# Altium schematic sheet CPU.SchDoc
size A3; SheetNumber: 1; SheetTotal: 1
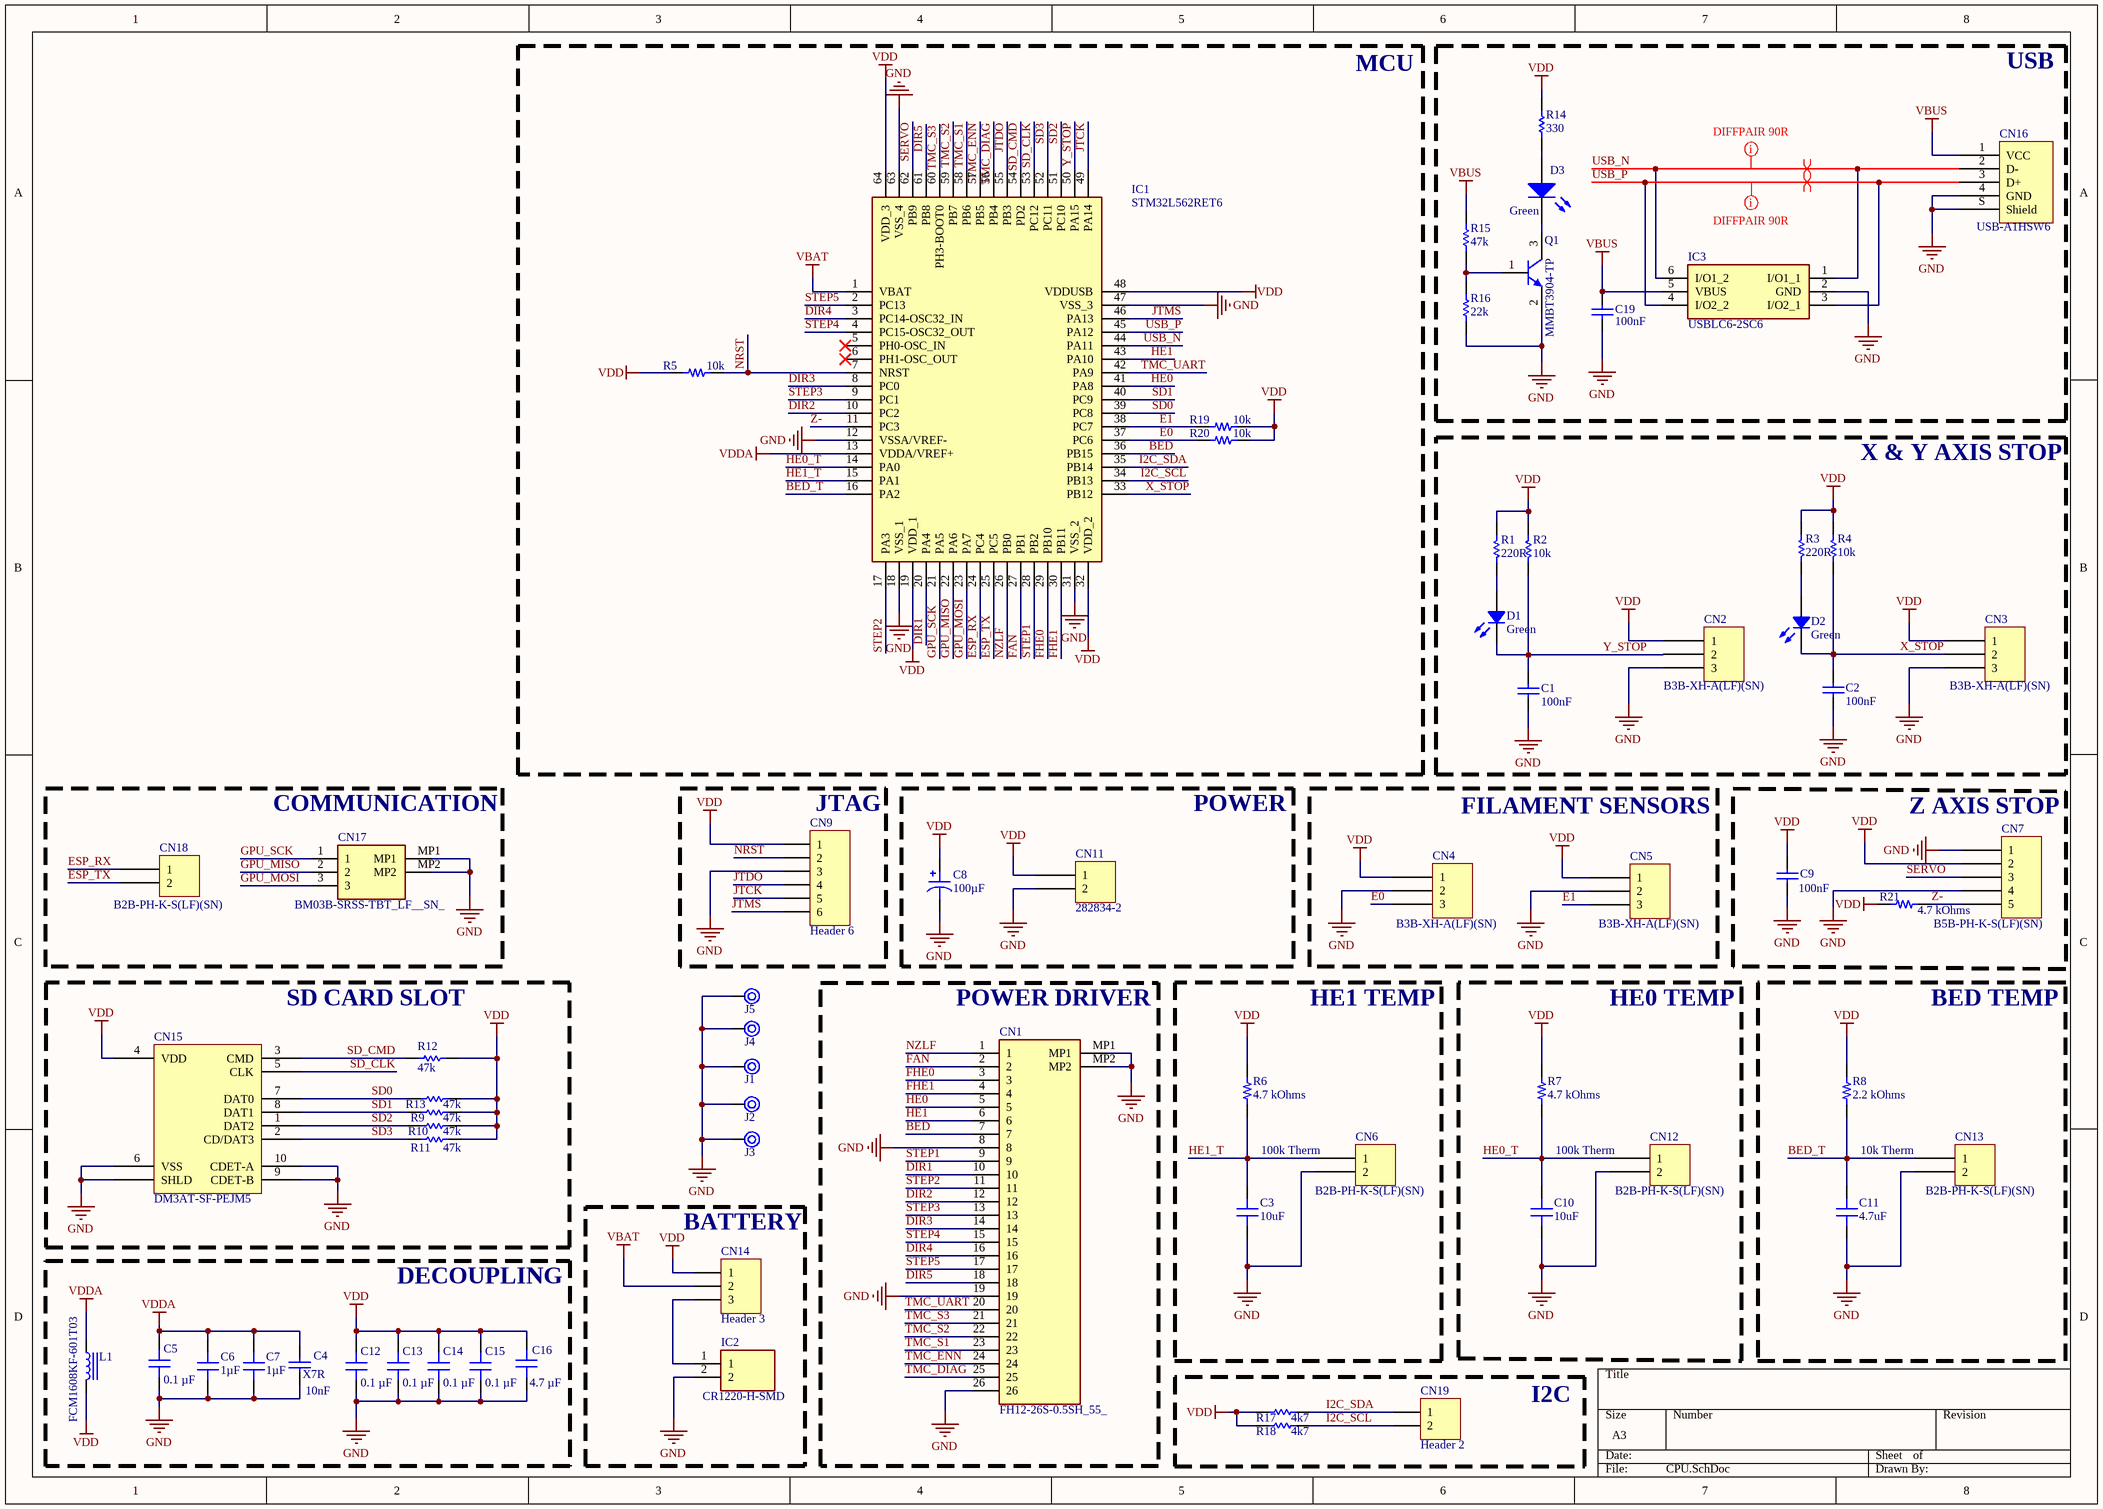
[diagram p0: CPU.SchDoc]

## Parts
C1  value 100nF  [1608[0603]]  (hidden comment: X5R)
C2  value 100nF  [1608[0603]]  (hidden comment: X5R)
C3  10uF  [CAP 0603_1608]
C4  X7R  value 10nF  [1608[0603]]
C5  0.1 µF  [CAP 0603_1608]
C6  1µF  [CAP 0603_1608]
C7  1µF  [CAP 0603_1608]
C8  100µF  [CAP ALSMD POLY 5.3MM H6.0MM]
C9  value 100nF  [1608[0603]]  (hidden comment: X5R)
C10  10uF  [CAP 0603_1608]
C11  4.7uF  [CAP 0603_1608]
C12  0.1 µF  [CAP 0603_1608]
C13  0.1 µF  [CAP 0603_1608]
C14  0.1 µF  [CAP 0603_1608]
C15  0.1 µF  [CAP 0603_1608]
C16  4.7 µF  [CAP 0603_1608]
C19  value 100nF  [1608[0603]]  (hidden comment: Cap)
CN1  FH12-26S-0.5SH_55_  [FH1226S05SH55]
CN2  B3B-XH-A(LF)(SN)  [JST XH B3B-XH-A]
CN3  B3B-XH-A(LF)(SN)  [JST XH B3B-XH-A]
CN4  B3B-XH-A(LF)(SN)  [JST XH B3B-XH-A]
CN5  B3B-XH-A(LF)(SN)  [JST XH B3B-XH-A]
CN6  B2B-PH-K-S(LF)(SN)  [JST B2B-PH-K]
CN7  B5B-PH-K-S(LF)(SN)  [JST B5B-PH-K]
CN9  Header 6  [HDR1X6]
CN11  282834-2  [TE 282834-2]
CN12  B2B-PH-K-S(LF)(SN)  [JST B2B-PH-K]
CN13  B2B-PH-K-S(LF)(SN)  [JST B2B-PH-K]
CN14  Header 3  [HDR1X3]
CN15  DM3AT-SF-PEJM5  [HIROSE DM3AT-SF-PEJM5]
CN16  USB-A1HSW6  [ON SHORE TECHNOLOGY USB-A1HSW6]
CN17  BM03B-SRSS-TBT_LF__SN_  [BM03BSRSSTBTLFSN]
CN18  B2B-PH-K-S(LF)(SN)  [JST B2B-PH-K]
CN19  Header 2  [HDR1X2]
D1  Green  [LED 0805_2012 GREEN]
D2  Green  [LED 0805_2012 GREEN]
D3  Green  [1608[0603]]
IC1  STM32L562RET6  [QFP50P1200X1200X160-64N]
IC2  CR1220-H-SMD  [CR1220HSMD]
IC3  USBLC6-2SC6  [SOT95P280X145-6N]
J1  PTH 3.2mm  [PTH 3.2mm]  (value not drawn)
J2  PTH 3.2mm  [PTH 3.2mm]  (value not drawn)
J3  PTH 3.2mm  [PTH 3.2mm]  (value not drawn)
J4  PTH 3.2mm  [PTH 3.2mm]  (value not drawn)
J5  PTH 3.2mm  [PTH 3.2mm]  (value not drawn)
L1  FCM1608KF-601T03  [IND 0603_1608 RF WW]
Q1  MMBT3904-TP  [MCCSEMI SOT-23-3]
R1  value 220R  [1608[0603]]  (hidden comment: Res1)
R2  value 10k  [1608[0603]]  (hidden comment: Res1)
R3  value 220R  [1608[0603]]  (hidden comment: Res1)
R4  value 10k  [1608[0603]]  (hidden comment: Res1)
R5  10k  [RES 0603_1608]
R6  4.7 kOhms  [RES 0603_1608]
R7  4.7 kOhms  [RES 0603_1608]
R8  2.2 kOhms  [RES 0603_1608]
R9  value 47k  [1608[0603]]  (hidden comment: Res1)
R10  value 47k  [1608[0603]]  (hidden comment: Res1)
R11  value 47k  [1608[0603]]  (hidden comment: Res1)
R12  value 47k  [1608[0603]]  (hidden comment: Res1)
R13  value 47k  [1608[0603]]  (hidden comment: Res1)
R14  value 330  [1608[0603]]  (hidden comment: Res1)
R15  value 47k  [1608[0603]]  (hidden comment: Res1)
R16  value 22k  [1608[0603]]  (hidden comment: Res1)
R17  value 4k7  [1608[0603]]  (hidden comment: Res1)
R18  value 4k7  [1608[0603]]  (hidden comment: Res1)
R19  10k  [RES 0603_1608]
R20  10k  [RES 0603_1608]
R21  4.7 kOhms  [RES 0603_1608]

## Blocks framed on the sheet
MCU: IC1 R5 R19 R20
USB: C19 CN16 D3 IC3 Q1 R14-R16
X & Y AXIS STOP: C1 C2 CN2 CN3 D1 D2 R1-R4
COMMUNICATION: CN17 CN18
JTAG: CN9
POWER: C8 CN11
FILAMENT SENSORS: CN4 CN5
Z AXIS STOP: C9 CN7 R21
SD CARD SLOT: CN15 R9-R13
POWER DRIVER: CN1
HE1 TEMP: C3 CN6 R6
HE0 TEMP: C10 CN12 R7
BED TEMP: C11 CN13 R8
BATTERY: CN14 IC2
DECOUPLING: C4-C7 C12-C16 L1
I2C: CN19 R17 R18

## Nets
GND: C1.2 C2.2 C3.1 C4.1 C5.1 C6.1 C7.1 C8.2 C9.2 C10.1 C11.1 C12.1 C13.1 C14.1 C15.1 C16.1 C19.1 CN1.8 CN1.19 CN1.26 CN1.MP1 CN1.MP2 CN2.3 CN3.3 CN4.2 CN5.2 CN6.2 CN7.1 CN7.4 CN9.3 CN11.2 CN12.2 CN13.2 CN15.6(VSS) CN15.9(CDET-B) CN15.10(CDET-A) CN15.S(SHLD) CN16.4(GND) CN16.S(Shield) CN17.MP1 CN17.MP2 IC1.12(VSSA/VREF-) IC1.18(VSS_1) IC1.31(VSS_2) IC1.47(VSS_3) IC1.63(VSS_4) IC2.2 IC3.2(GND) J1.0 J2.0 J3.0 J4.0 J5.0 Q1.2(E) R16.1
VBAT: CN14.2 IC1.1(VBAT)
VBUS: C19.2 CN16.1(VCC) IC3.5(VBUS) R15.2
VDD: C8.1 C9.1 C12.2 C13.2 C14.2 C15.2 C16.2 CN2.1 CN3.1 CN4.1 CN5.1 CN7.2 CN9.1 CN11.1 CN14.1 CN15.4(VDD) IC1.19(VDD_1) IC1.32(VDD_2) IC1.48(VDDUSB) IC1.64(VDD_3) L1.2 R1.1 R2.1 R3.1 R4.1 R5.1 R6.2 R7.2 R8.2 R9.1 R10.2 R11.2 R12.1 R13.2 R14.2 R17.1 R18.1 R19.2 R20.2 R21.2
VDDA: C4.2 C5.2 C6.2 C7.2 IC1.13(VDDA/VREF+) L1.1
BED: CN1.7 IC1.36(PB15)
BED_T: C11.2 CN13.1 IC1.16(PA2) R8.1
DIR1: CN1.10 IC1.20(PA4)
DIR2: CN1.12 IC1.10(PC2)
DIR3: CN1.14 IC1.8(PC0)
DIR4: CN1.16 IC1.3(PC14-OSC32_IN)
DIR5: CN1.18 IC1.61(PB8)
E0: CN4.3 IC1.37(PC6) R20.1
E1: CN5.3 IC1.38(PC7) R19.1
ESP_RX: CN18.1 IC1.24(PC4)
ESP_TX: CN18.2 IC1.25(PC5)
FAN: CN1.2 IC1.27(PB1)
FHE0: CN1.3 IC1.29(PB10)
FHE1: CN1.4 IC1.30(PB11)
GPU_MISO: CN17.2 IC1.22(PA6)
GPU_MOSI: CN17.3 IC1.23(PA7)
GPU_SCK: CN17.1 IC1.21(PA5)
HE0: CN1.5 IC1.41(PA8)
HE0_T: C10.2 CN12.1 IC1.14(PA0) R7.1
HE1: CN1.6 IC1.43(PA10)
HE1_T: C3.2 CN6.1 IC1.15(PA1) R6.1
I2C_SCL: CN19.2 IC1.34(PB13) R18.2
I2C_SDA: CN19.1 IC1.35(PB14) R17.2
JTCK: CN9.5 IC1.49(PA14)
JTDO: CN9.4 IC1.55(PB3)
JTMS: CN9.6 IC1.46(PA13)
NRST: CN9.2 IC1.7(NRST) R5.2
NZLF: CN1.1 IC1.26(PB0)
SD0: CN15.7(DAT0) IC1.39(PC8) R13.1
SD1: CN15.8(DAT1) IC1.40(PC9) R9.2
SD2: CN15.1(DAT2) IC1.51(PC10) R10.1
SD3: CN15.2(CD/DAT3) IC1.52(PC11) R11.1
SD_CLK: CN15.5(CLK) IC1.53(PC12)
SD_CMD: CN15.3(CMD) IC1.54(PD2) R12.2
SERVO: CN7.3 IC1.62(PB9)
STEP1: CN1.9 IC1.28(PB2)
STEP2: CN1.11 IC1.17(PA3)
STEP3: CN1.13 IC1.9(PC1)
STEP4: CN1.15 IC1.4(PC15-OSC32_OUT)
STEP5: CN1.17 IC1.2(PC13)
TMC_DIAG: CN1.25 IC1.56(PB4)
TMC_ENN: CN1.24 IC1.57(PB5)
TMC_S1: CN1.23 IC1.58(PB6)
TMC_S2: CN1.22 IC1.59(PB7)
TMC_S3: CN1.21 IC1.60(PH3-BOOT0)
TMC_UART: CN1.20 IC1.42(PA9)
USB_N: CN16.2(D-) IC1.44(PA11) IC3.1(I/O1_1) IC3.6(I/O1_2)
USB_P: CN16.3(D+) IC1.45(PA12) IC3.3(I/O2_1) IC3.4(I/O2_2)
X_STOP: C2.1 CN3.2 D2.2 IC1.33(PB12) R4.2
Y_STOP: C1.1 CN2.2 D1.2 IC1.50(PA15) R2.2
Z-: CN7.5 IC1.11(PC3) R21.1
NetCN14_3: CN14.3 IC2.1
NetD1_1: D1.1 R1.2
NetD2_1: D2.1 R3.2
NetD3_1: D3.1(A) R14.1
NetD3_2: D3.2(K) Q1.3(C)
NetQ1_1: Q1.1(B) R15.1 R16.2

Not connected (* = marked no-connect by the designer): IC1 5(PH0-OSC_IN)* 6(PH1-OSC_OUT)*

## Layout directives
mark named DIFFPAIR 90R: USB_N, USB_P
differential pair: USB_N, USB_P

## Notes on the sheet
- 100k Therm
- 10k Therm

## Library data of the parts
C1 C2 C4 C9 C19 = Cap: Capacitor; Published: 8-Jun-2000; LatestRevisionDate: 17-Jul-2002; LatestRevisionNote: Re-released for DXP Platform.; PackageReference: RAD-0.3; Publisher: Altium Limited; PackageDescription: Radial Cap, Thru-Hole; 2 Leads; 0.3 in Pin Spacing
C3 C10 C11 = 0603YD105KAT4A: CAP CER 1UF 16V X5R 0603; manufacturer: AVX Corporation; Value: 1µF; Tolerance: ±10%; Part Number: 0603YD105KAT4A; Applications: General Purpose; Capacitance: 1µF; componentlink1description: Datasheet; componentlink1url: http://datasheets.avx.com/cx5r.pdf; componentlink2description: DigiKey Link; componentlink2url: http://digikey.com/product-detail/en/avx-corporation/0603YD105KAT4A/478-10365-1-ND/6797443; Device Package: 0603 (1608 Metric); lastupdated: 9/2/2020 1:03:10 AM; Lifecycle Status: Active; Minimum Order: 1; Mounting Type: Surface Mount, MLCC; Operating Temperature: -55°C ~ 85°C; Package / Case: 0603 (1608 Metric); packaging: TapeAndReel; partid: 15257; Part Status: Active; price: 0.03; series: -; Size / Dimension: 0.063" L x 0.032" W (1.60mm x 0.81mm); Supplier 1: DigiKey; Supplier Part Number 1: 478-10365-1-ND; Temperature Coefficient: X5R; Thickness (Max): 0.035" (0.90mm); Voltage - Rated: 16V
C5 C12-C15 = 0603B104K101CT: CAP CER 0.1UF 100V X7R 0603; manufacturer: Walsin Technology Corporation; Tolerance: ±10%; Part Number: 0603B104K101CT; Value: 0.1 µF; Applications: General Purpose; Capacitance: 0.1 µF; componentlink1description: Datasheet; componentlink1url: http://www.passivecomponent.com/wp-content/uploads/2018/10/MLCC.pdf; componentlink2description: DigiKey Link; componentlink2url: https://www.digikey.com/en/products/detail/walsin-technology-corporation/0603B104K101CT/9354889; Device Package: 0603 (1608 Metric); lastupdated: 4/8/2023 7:09:18 PM; Lifecycle Status: Active; Minimum Order: 1; Mounting Type: Surface Mount, MLCC; Operating Temperature: -55°C ~ 125°C; Package / Case: 0603 (1608 Metric); packaging: TapeAndReel; partid: 4273; Part Status: Active; price: 0.01; series: -; Size / Dimension: 0.063" L x 0.031" W (1.60mm x 0.80mm); Supplier 1: DigiKey; Supplier Part Number 1: 1292-1392-1-ND; Temperature Coefficient: X7R; Thickness (Max): 0.037" (0.95mm); Voltage - Rated: 100V
C6 C7 = 0603YD105KAT4A: CAP CER 1UF 16V X5R 0603; manufacturer: AVX Corporation; Tolerance: ±10%; Part Number: 0603YD105KAT4A; Value: 1µF; Applications: General Purpose; Capacitance: 1µF; componentlink1description: Datasheet; componentlink1url: http://datasheets.avx.com/cx5r.pdf; componentlink2description: DigiKey Link; componentlink2url: http://digikey.com/product-detail/en/avx-corporation/0603YD105KAT4A/478-10365-1-ND/6797443; Device Package: 0603 (1608 Metric); lastupdated: 9/2/2020 1:03:10 AM; Lifecycle Status: Active; Minimum Order: 1; Mounting Type: Surface Mount, MLCC; Operating Temperature: -55°C ~ 85°C; Package / Case: 0603 (1608 Metric); packaging: TapeAndReel; partid: 15257; Part Status: Active; price: 0.03; series: -; Size / Dimension: 0.063" L x 0.032" W (1.60mm x 0.81mm); Supplier 1: DigiKey; Supplier Part Number 1: 478-10365-1-ND; Temperature Coefficient: X5R; Thickness (Max): 0.035" (0.90mm); Voltage - Rated: 16V
C8 = 6SVPC100M: CAP ALUM POLY 100UF 20% 6.3V SMD; manufacturer: Panasonic Electronic Components; ESR (Equivalent Series Resistance): 30mOhm; Lifetime @ Temp.: 2000 Hrs @ 105°C; Ripple Current @ High Frequency: 2.15A @ 100kHz; Ripple Current @ Low Frequency: 107.5mA @ 120Hz; Surface Mount Land Size: 0.209" L x 0.209" W (5.30mm x 5.30mm); Type: Polymer; Part Number: 6SVPC100M; Applications: General Purpose; Capacitance: 100µF; componentlink1description: Datasheet; componentlink1url: https://industrial.panasonic.com/cdbs/www-data/pdf/AAB8000/AAB8000C256.pdf; componentlink2description: DigiKey Link; componentlink2url: http://digikey.com/product-detail/en/panasonic-electronic-components/6SVPC100M/P16606CT-ND/4204442; Device Package: Radial, Can - SMD; Height - Seated (Max): 0.236" (6.00mm); lastupdated: 9/2/2020 1:22:07 AM; Lifecycle Status: Active; Minimum Order: 1; Mounting Type: Surface Mount; Operating Temperature: -55°C ~ 105°C; Package / Case: Radial, Can - SMD; packaging: TapeAndReel; partid: 1943; Part Status: Active; price: 0.51; series: OS-CON™, SVPC; Size / Dimension: 0.197" Dia (5.00mm); Supplier 1: DigiKey; Supplier Part Number 1: P16606CT-ND; Tolerance: ±20%; value: 100µF; Voltage - Rated: 6.3V
C16 = GRM185R61C475KE11D: CAP CER 4.7UF 16V X5R 0603; manufacturer: Murata Electronics; Tolerance: ±10%; Part Number: GRM185R61C475KE11D; Value: 4.7 µF; Applications: General Purpose; Capacitance: 4.7 µF; componentlink1description: Datasheet; componentlink1url: https://search.murata.co.jp/Ceramy/image/img/A01X/G101/ENG/GRM185R61C475KE11-01.pdf; componentlink2description: DigiKey Link; componentlink2url: https://www.digikey.com/en/products/detail/murata-electronics/GRM185R61C475KE11D/6606088; Device Package: 0603 (1608 Metric); lastupdated: 3/28/2023 7:09:04 PM; Lifecycle Status: Active; Minimum Order: 1; Mounting Type: Surface Mount, MLCC; Operating Temperature: -55°C ~ 85°C; Package / Case: 0603 (1608 Metric); packaging: TapeAndReel; partid: 2451; Part Status: Active; price: 0.05; series: GRM; Size / Dimension: 0.063" L x 0.031" W (1.60mm x 0.80mm); Supplier 1: DigiKey; Supplier Part Number 1: 490-14459-1-ND; Temperature Coefficient: X5R; Thickness (Max): 0.022" (0.55mm); Voltage - Rated: 16V
CN1 = FH12-26S-0.5SH_55_: Connector; Manufacturer_Name: Hirose; Manufacturer_Part_Number: FH12-26S-0.5SH(55); Datasheet Link: https://datasheet.datasheetarchive.com/originals/distributors/SFDatasheet-1/sf-00023459.pdf; Height: 2.2mm; Mouser Part Number: 798-FH12-26S-0.5SH55; Mouser Price/Stock: https://www.mouser.co.uk/ProductDetail/Hirose-Connector/FH12-26S-0.5SH55?qs=Ux3WWAnHpjC%2FipJJsmJDaQ%3D%3D; Arrow Part Number: FH12-26S-0.5SH(55); Arrow Price/Stock: https://www.arrow.com/en/products/fh12-26s-0.5sh-55/hirose-electric
CN2-CN5 = B3B-XH-A(LF)(SN): CONN HEADER VERT 3POS 2.5MM; Manufacturer: JST Sales America Inc.; Contact Length - Post: 0.134" (3.40mm); Current Rating (Amps): 3A; Material Flammability Rating: UL94 V-0; Number of Positions: 3; Number of Positions Loaded: All; Pitch - Mating: 0.098" (2.50mm); Shrouding: Shrouded - 4 Wall; Style: Board to Cable/Wire; Voltage Rating: 250V; Part Number: B3B-XH-A(LF)(SN); ComponentLink1Description: Datasheet; ComponentLink1URL: http://www.jst-mfg.com/product/pdf/eng/eXH.pdf; ComponentLink2Description: DigiKey Link; ComponentLink2URL: http://digikey.com/product-detail/en/jst-sales-america-inc/B3B-XH-A-LF-SN/455-2248-ND/1651046; Connector Type: Header; Contact Finish - Mating: Tin; Contact Finish - Post: Tin; Contact Material: Brass; Contact Shape: Square; Contact Type: Male Pin; Fastening Type: Detent Lock; Insulation Color: Natural; Insulation Height: 0.276" (7.00mm); Insulation Material: Polyamide (PA66), Nylon 6/6; LastUpdated: 1/12/2020 11:46:22 PM; Lifecycle Status: Active; Minimum Order: 1; Mounting Type: Through Hole; Number of Rows: 1; Operating Temperature: -25°C ~ 85°C; Packaging: Bulk; PartId: 68; Part Status: Active; Price: 0.19; Series: XH; Supplier 1: DigiKey; Supplier Part Number 1: 455-2248-ND; Termination: Press-Fit, Solder
CN6 CN12 CN13 CN18 = B2B-PH-K-S(LF)(SN): CONN HEADER VERT 2POS 2MM; Manufacturer: JST Sales America Inc.; Contact Length - Mating: 0.130" (3.30mm); Contact Length - Post: 0.134" (3.40mm); Current Rating (Amps): 2A; Material Flammability Rating: UL94 V-0; Number of Positions: 2; Number of Positions Loaded: All; Overall Contact Length: 0.333" (8.45mm); Pitch - Mating: 0.079" (2.00mm); Shrouding: Shrouded - 4 Wall; Style: Board to Cable/Wire; Voltage Rating: 100V; Part Number: B2B-PH-K-S(LF)(SN); ComponentLink1Description: Datasheet; ComponentLink1URL: http://www.jst-mfg.com/product/pdf/eng/ePH.pdf; ComponentLink2Description: DigiKey Link; ComponentLink2URL: http://digikey.com/product-detail/en/jst-sales-america-inc/B2B-PH-K-S-LF-SN/455-1704-ND/926611; Connector Type: Header; Contact Finish - Mating: Tin; Contact Finish - Post: Tin; Contact Material: Brass; Contact Shape: Square; Contact Type: Male Pin; Fastening Type: Detent Lock; Insulation Color: Natural; Insulation Height: 0.236" (6.00mm); Insulation Material: Polyamide (PA66), Nylon 6/6; LastUpdated: 1/3/2020 11:40:58 PM; Lifecycle Status: Active; Minimum Order: 1; Mounting Type: Through Hole; Number of Rows: 1; Operating Temperature: -25°C ~ 85°C; Packaging: Bulk; PartId: 11; Part Status: Active; Price: 0.17; Series: PH; Supplier 1: DigiKey; Supplier Part Number 1: 455-1704-ND; Termination: Press-Fit, Solder
CN7 = B5B-PH-K-S(LF)(SN): CONN HEADER VERT 5POS 2MM; Manufacturer: JST Sales America Inc.; Contact Length - Mating: 0.130" (3.30mm); Contact Length - Post: 0.134" (3.40mm); Current Rating (Amps): 2A; Material Flammability Rating: UL94 V-0; Number of Positions: 5; Number of Positions Loaded: All; Overall Contact Length: 0.333" (8.45mm); Pitch - Mating: 0.079" (2.00mm); Shrouding: Shrouded - 4 Wall; Style: Board to Cable/Wire; Voltage Rating: 100V; Part Number: B5B-PH-K-S(LF)(SN); ComponentLink1Description: Datasheet; ComponentLink1URL: http://www.jst-mfg.com/product/pdf/eng/ePH.pdf; ComponentLink2Description: DigiKey Link; ComponentLink2URL: http://digikey.com/product-detail/en/jst-sales-america-inc/B5B-PH-K-S-LF-SN/455-1707-ND/926614; Connector Type: Header; Contact Finish - Mating: Tin; Contact Finish - Post: Tin; Contact Material: Brass; Contact Shape: Square; Contact Type: Male Pin; Fastening Type: Detent Lock; Insulation Color: Natural; Insulation Height: 0.236" (6.00mm); Insulation Material: Polyamide (PA66), Nylon 6/6; LastUpdated: 1/12/2020 10:30:05 PM; Lifecycle Status: Active; Minimum Order: 1; Mounting Type: Through Hole; Number of Rows: 1; Operating Temperature: -25°C ~ 85°C; Packaging: Bulk; PartId: 28; Part Status: Active; Price: 0.29; Series: PH; Supplier 1: DigiKey; Supplier Part Number 1: 455-1707-ND; Termination: Press-Fit, Solder
CN9 = Header 6: Header, 6-Pin; LatestRevisionDate: 17-Jul-2002; LatestRevisionNote: Re-released for DXP Platform.; Publisher: Altium Limited
CN11 = 282834-2: TERM BLK 2P SIDE ENT 2.54MM PCB; Manufacturer: TE Connectivity AMP Connectors; Current: 10A; Mating Orientation: Horizontal with Board; Number of Levels: 1; Pitch: 0.100" (2.54mm); Positions Per Level: 2; Voltage: 150V; Wire Gauge: 16-30 AWG; Wire Termination: Screw - Rising Cage Clamp; Part Number: 282834-2; Color: Green; ComponentLink1Description: Datasheet; ComponentLink1URL: https://www.te.com/commerce/DocumentDelivery/DDEController?Action=srchrtrv&DocNm=282834&DocType=Customer+Drawing&DocLang=English; ComponentLink2Description: DigiKey Link; ComponentLink2URL: http://digikey.com/product-detail/en/te-connectivity-amp-connectors/282834-2/A98333-ND/1150135; LastUpdated: 1/15/2020 4:15:38 AM; Lifecycle Status: Active; Minimum Order: 1; Mounting Type: Through Hole; Packaging: Bulk; Part Status: Active; Price: 0.88; Series: Buchanan; Supplier 1: DigiKey; Supplier Part Number 1: A98333-ND
CN14 = Header 3: Header, 3-Pin; LatestRevisionDate: 17-Jul-2002; LatestRevisionNote: Re-released for DXP Platform.; Publisher: Altium Limited
CN15 = DM3AT-SF-PEJM5: CONN MICRO SD CARD PUSH-PUSH R/A; Manufacturer: Hirose Electric Co Ltd; Card Type: Secure Digital - microSD™; Connector Type: Connector and Ejector; Insertion, Removal Method: Push In, Push Out; Number of Positions: 10 (8 + 2); Part Number: DM3AT-SF-PEJM5; ComponentLink1Description: Datasheet; ComponentLink1URL: https://www.hirose.com/product/document?clcode=CL0609-0033-6-00&productname=DM3AT-SF-PEJ2M5&series=DM3&documenttype=Catalog&lang=en&documentid=D49662_en; ComponentLink2Description: DigiKey Link; ComponentLink2URL: //digikey.com/product-detail/en/hirose-electric-co-ltd/DM3AT-SF-PEJM5/HR1964TR-ND/2533565; Contact Finish: Gold; Features: Switch; Height Above Board: 0.066" (1.68mm); LastUpdated: 12/16/2019 8:34:40 PM; Lifecycle Status: 0; Minimum Order: 1; Mounting Feature: Normal, Standard - Top; Mounting Type: Surface Mount, Right Angle; Packaging: TapeAndReel; Part Status: Active; Price: 1.41; Series: DM3; Supplier 1: DigiKey; Supplier Part Number 1: HR1964TR-ND
CN16 = USB-A1HSW6: CONN RCPT TYPEA 4POS R/A; Manufacturer: On Shore Technology Inc.; Connector Type: USB - A; Current Rating (Amps): 1A; Gender: Receptacle; Number of Contacts: 4; Number of Ports: 1; Shielding: Unshielded; Voltage - Rated: 30VAC; Part Number: USB-A1HSW6; ComponentLink1Description: Datasheet; ComponentLink1URL: http://www.on-shore.com/wp-content/uploads/USB-A1HSXX.pdf; ComponentLink2Description: DigiKey Link; ComponentLink2URL: http://digikey.com/product-detail/en/on-shore-technology-inc/USB-A1HSW6/ED2989-ND/2677750; Features: Board Lock; LastUpdated: 4/30/2020 11:56:44 AM; Lifecycle Status: Active; Minimum Order: 1; Mounting Feature: Horizontal; Mounting Type: Through Hole, Right Angle; Operating Temperature: 0°C ~ 85°C; Packaging: Tray; Part Status: Active; Price: 0.48; Series: -; Supplier 1: DigiKey; Supplier Part Number 1: ED2989-ND; Termination: Solder
CN17 = BM03B-SRSS-TBT_LF__SN_: Connector; Manufacturer_Name: JST (JAPAN SOLDERLESS TERMINALS); Manufacturer_Part_Number: BM03B-SRSS-TBT(LF)(SN); Datasheet Link: http://www.jst-mfg.com/product/pdf/eng/eSR.pdf; Height: 4.25mm; Arrow Part Number: BM03B-SRSS-TBT(LF)(SN); Arrow Price/Stock: https://www.arrow.com/en/products/bm03b-srss-tbt-lf-sn/jst-manufacturing
CN19 = Header 2: Header, 2-Pin; LatestRevisionDate: 17-Jul-2002; LatestRevisionNote: Re-released for DXP Platform.; Publisher: Altium Limited
D1 D2 = QTLP630C4TR: LED GREEN CLEAR 0805 SMD; Manufacturer: Everlight Electronics Co Ltd; Configuration: Standard; Current - Test: 20mA; Lens Color: Colorless; Lens Size: 1.40mm x 1.25mm; Lens Style: Rectangle with Flat Top; Millicandela Rating: 10mcd; Viewing Angle: 140°; Voltage - Forward (Vf) (Typ): 2.1V; Wavelength - Dominant: 570nm; Wavelength - Peak: 565nm; Part Number: QTLP630C4TR; Color: Green; ComponentLink1Description: Datasheet; ComponentLink1URL: //media.digikey.com/PDF/Data%20Sheets/Everlight%20PDFs/QTLP630-2.pdf; ComponentLink2Description: DigiKey Link; ComponentLink2URL: https://www.digikey.com/en/products/detail/everlight-electronics-co-ltd/QTLP630C4TR/2675902; Device Package: 0805 (2012 Metric); Height (Max): 1.20mm; LastUpdated: 3/28/2023 7:59:32 PM; Lens Transparency: Clear; Lifecycle Status: Active; Minimum Order: 1; Mounting Type: Surface Mount; Package / Case: 0805 (2012 Metric); Packaging: TapeAndReel; PartId: 240; Part Status: Active; Price: 0.04; Series: -; Size / Dimension: 2.00mm L x 1.25mm W; Supplier 1: DigiKey; Supplier Part Number 1: 1080-1411-1-ND; Supplier Device Package: 0805; Value: Green
D3 = LED3: Typical BLUE SiC LED; Published: 8-Jun-2000; LatestRevisionDate: 17-Dec-2003; LatestRevisionNote: PCB Footprint replaced.; DatasheetVersion: 16-Apr-2002; PackageVersion: 16-Apr-2002; PackageReference: 3.5X2.8X1.9; Publisher: Altium Limited; PackageDescription: SM LED; 2 C-Bend Leads; Body 3.5 x 2.8 x 1.9 mm, inc leads (LxWxH typ)
IC1 = STM32L562RET6: Integrated Circuit; Manufacturer_Name: STMicroelectronics; Datasheet Link: https://www.st.com/resource/en/datasheet/stm32l562ve.pdf; Height: 1.6mm; Manufacturer_Part_Number: STM32L562RET6; Mouser Part Number: 511-STM32L562RET6; Mouser Price/Stock: https://www.mouser.co.uk/ProductDetail/STMicroelectronics/STM32L562RET6?qs=%252B6g0mu59x7IOhyLRk%252BE%2Fjw%3D%3D; Arrow Part Number: STM32L562RET6; Arrow Price/Stock: https://www.arrow.com/en/products/stm32l562ret6/stmicroelectronics?region=nac
IC2 = CR1220-H-SMD: Integrated Circuit; Manufacturer_Name: ROBOTIS; Datasheet Link: https://www.robotics.org.za/CR1220-H-SMD; Height: 4.1mm; Manufacturer_Part_Number: CR1220-H-SMD
IC3 = USBLC6-2SC6: Integrated Circuit; Manufacturer_Name: STMicroelectronics; Datasheet Link: http://www.st.com/st-web-ui/static/active/en/resource/technical/document/datasheet/CD00050750.pdf; Height: 1.45mm; Manufacturer_Part_Number: USBLC6-2SC6; Mouser Part Number: 511-USBLC6-2SC6; Mouser Price/Stock: https://www.mouser.co.uk/ProductDetail/STMicroelectronics/USBLC6-2SC6?qs=po45yt2pPpu%2FhNIlwQdTlg%3D%3D; Arrow Part Number: USBLC6-2SC6; Arrow Price/Stock: https://www.arrow.com/en/products/usblc6-2sc6/stmicroelectronics?region=nac
L1 = 744917127: FIXED IND 27NH 780MA 200 MOHM; Manufacturer: Würth Elektronik; DC Resistance (DCR): 200mOhm Max; Frequency - Self Resonant: 2.8GHz; Inductance Frequency - Test: 250MHz; Material - Core: Ceramic; Q @ Freq: 35 @ 250MHz; Shielding: Unshielded; Tolerance: ±2%; Type: Wirewound; Part Number: 744917127; ComponentLink1Description: Datasheet; ComponentLink1URL: https://katalog.we-online.de/pbs/datasheet/744917127.pdf; ComponentLink2Description: DigiKey Link; ComponentLink2URL: http://digikey.com/product-detail/en/w-rth-elektronik/744917127/732-11279-1-ND/6833738; Current Rating (Amps): 780mA; Device Package: 0603 (1608 Metric); Height - Seated (Max): 0.043" (1.10mm); Inductance: 27nH; LastUpdated: 9/6/2020 11:05:16 AM; Lifecycle Status: Active; Minimum Order: 0; Mounting Type: Surface Mount; Operating Temperature: -40°C ~ 125°C; Package / Case: 0603 (1608 Metric); Packaging: TapeAndReel; PartId: 832; Part Status: Active; Price: 0.46; Series: WE-KI HC; Size / Dimension: 0.067" L x 0.043" W (1.70mm x 1.10mm); Supplier 1: DigiKey; Supplier Part Number 1: 732-11279-1-ND; Supplier Device Package: 0603 (1608 Metric); Value: 27nH
Q1 = MMBT3904-TP: TRANS NPN 40V 0.2A SOT23; Manufacturer: Micro Commercial Co; Current - Collector Cutoff (Max): 50nA (ICBO); Current - Collector (Ic) (Max): 200 mA; DC Current Gain (hFE) (Min) @ Ic, Vce: 100 @ 10mA, 1V; Frequency - Transition: 300MHz; Power - Max: 350 mW; Vce Saturation (Max) @ Ib, Ic: 300mV @ 5mA, 50mA; Part Number: MMBT3904-TP; ComponentLink1Description: Datasheet; ComponentLink1URL: https://www.mccsemi.com/pdf/Products/MMBT3904(SOT-23).pdf; ComponentLink2Description: DigiKey Link; ComponentLink2URL: https://www.digikey.com/en/products/detail/micro-commercial-co/MMBT3904-TP/717280; LastUpdated: 2/3/2023 9:11:21 PM; Lifecycle Status: Active; Minimum Order: 1; Mounting Type: Surface Mount; Operating Temperature: -55°C ~ 150°C (TJ); Package / Case: TO-236-3, SC-59, SOT-23-3; Packaging: TapeAndReel; PartId: 260; Part Status: Active; Price: 0.01; Series: -; Supplier 1: DigiKey; Supplier Part Number 1: MMBT3904TPMSCT-ND; Supplier Device Package: SOT-23; Transistor Type: NPN; Voltage - Collector Emitter Breakdown (Max): 40 V
R1-R4 R9-R18 = Res1: Resistor; Published: 8-Jun-2000; LatestRevisionDate: 17-Jul-2002; LatestRevisionNote: Re-released for DXP Platform.; PackageReference: AXIAL-0.3; Publisher: Altium Limited; PackageDescription: Axial Device, Thru-Hole; 2 Leads; 0.3 in Pin Spacing
R5 R19 R20 = RC0603FR-7W10KL: RES 10K OHM 1% 1/5W 0603; Manufacturer: Yageo; Power (Watts): 0.2W, 1/5W; Resistance: 10 kOhms; Temperature Coefficient: ±200ppm/°C; Part Number: RC0603FR-7W10KL; Value: 10k; ComponentLink1Description: Datasheet; ComponentLink1URL: https://www.yageo.com/upload/media/product/productsearch/datasheet/rchip/PYu-RC_Group_51_RoHS_L_11.pdf; ComponentLink2Description: DigiKey Link; ComponentLink2URL: https://www.digikey.com/en/products/detail/yageo/RC0603FR-7W10KL/12698809; Composition: Thick Film; Device Package: 0603 (1608 Metric); Features: Moisture Resistant; Height - Seated (Max): 0.022" (0.55mm); LastUpdated: 4/8/2023 7:28:57 PM; Lifecycle Status: Active; Minimum Order: 1; Number of Terminations: 2; Operating Temperature: -55°C ~ 155°C; Package / Case: 0603 (1608 Metric); Packaging: CutTape; PartId: 67088; Part Status: Active; Price: 0.01; Series: RC_L; Size / Dimension: 0.063" L x 0.031" W (1.60mm x 0.80mm); Supplier 1: DigiKey; Supplier Part Number 1: 13-RC0603FR-7W10KLCT-ND; Supplier Device Package: 0603; Tolerance: ±1%
R6 R7 R21 = RS73G1JTTD4701B: RES 4.7K OHM 0.1% 1/5W 0603; Manufacturer: KOA Speer Electronics, Inc.; Power (Watts): 0.2W, 1/5W; Temperature Coefficient: ±50ppm/°C; Part Number: RS73G1JTTD4701B; Value: 4.7 kOhms; ComponentLink1Description: Datasheet; ComponentLink1URL: http://www.koaspeer.com/pdfs/RS73.pdf; ComponentLink2Description: DigiKey Link; ComponentLink2URL: https://www.digikey.com/en/products/detail/koa-speer-electronics-inc/RS73G1JTTD4701B/11594383; Composition: Thick Film; Device Package: 0603 (1608 Metric); Features: Automotive AEC-Q200, Moisture Resistant; Height - Seated (Max): 0.022" (0.55mm); LastUpdated: 4/17/2023 7:36:04 PM; Lifecycle Status: Active; Minimum Order: 1; Number of Terminations: 2; Operating Temperature: -55°C ~ 155°C; Package / Case: 0603 (1608 Metric); Packaging: TapeAndReel; PartId: 56376; Part Status: Active; Price: 0.08; Ratings: AEC-Q200; Resistance: 4.7 kOhms; Series: RS73; Size / Dimension: 0.063" L x 0.031" W (1.60mm x 0.80mm); Supplier 1: DigiKey; Supplier Part Number 1: 2019-RS73G1JTTD4701BCT-ND; Supplier Device Package: 0603; Tolerance: ±0.1%
R8 = RS73G1JTTD2201B: RES 2.2K OHM 0.1% 1/5W 0603; Manufacturer: KOA Speer Electronics, Inc.; Power (Watts): 0.2W, 1/5W; Temperature Coefficient: ±50ppm/°C; Part Number: RS73G1JTTD2201B; Value: 2.2 kOhms; ComponentLink1Description: Datasheet; ComponentLink1URL: https://www.koaspeer.com/pdfs/RS73.pdf; ComponentLink2Description: DigiKey Link; ComponentLink2URL: https://www.digikey.com/en/products/detail/koa-speer-electronics-inc/RS73G1JTTD2201B/11592705; Composition: Thick Film; Device Package: 0603 (1608 Metric); Features: Automotive AEC-Q200, Moisture Resistant; Height - Seated (Max): 0.022" (0.55mm); LastUpdated: 4/17/2023 7:35:13 PM; Lifecycle Status: Active; Minimum Order: 1; Number of Terminations: 2; Operating Temperature: -55°C ~ 155°C; Package / Case: 0603 (1608 Metric); Packaging: TapeAndReel; PartId: 70678; Part Status: Active; Price: 0.08; Ratings: AEC-Q200; Resistance: 2.2 kOhms; Series: RS73; Size / Dimension: 0.063" L x 0.031" W (1.60mm x 0.80mm); Supplier 1: DigiKey; Supplier Part Number 1: 2019-RS73G1JTTD2201BCT-ND; Supplier Device Package: 0603; Tolerance: ±0.1%